# EAGLE design Energy meter1 (EAGLE 7.6.0)
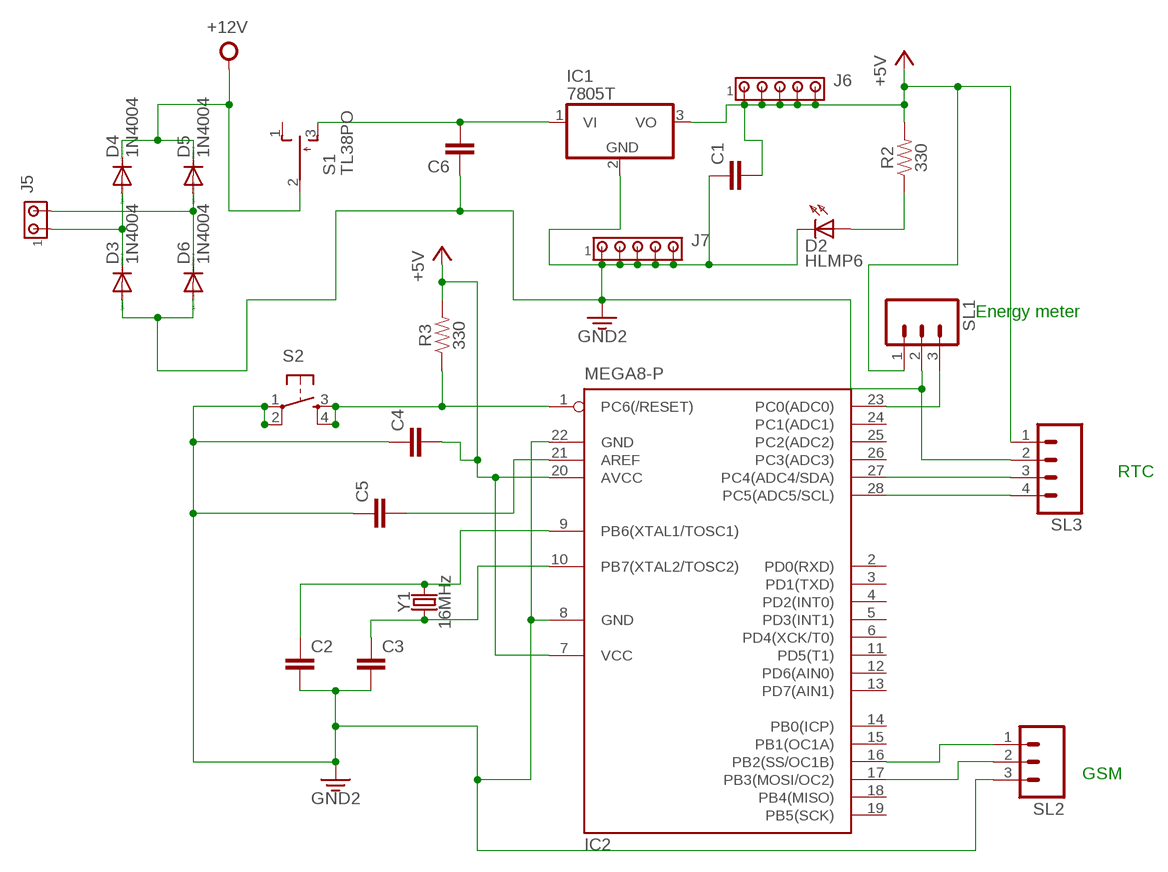
[diagram p0: schematic, sheet 1]

## Parts
C1  C5/2.5  [C5B2.5]
C2  C5/2.5  [C5B2.5]
C3  C5/2.5  [C5B2.5]
C4  C5/2.5  [C5B2.5]
C5  C5/2.5  [C5B2.5]
C6  C5/2.5  [C5B2.5]
D2  HLMP6  [HLMP6]
D3  1N4004  [DO41-10]
D4  1N4004  [DO41-10]
D5  1N4004  [DO41-10]
D6  1N4004  [DO41-10]
IC1  7805T  [TO220H]
IC2  MEGA8-P  [DIL28-3]
J5  MTA02-156  [1X2MTA]
J6  MTA05-100  [10X05MTA]
J7  MTA05-100  [10X05MTA]
R2  330  330OHM-HORIZ-1/10W-5%  [AXIAL-0.3]
R3  330  330OHM-HORIZ-1/10W-5%  [AXIAL-0.3]
S1  TL38PO  [TL3XPO]
S2  TAC_SWITCHPTH  [TACTILE-PTH]
SL1  MA03  [03P]
SL2  MA03  [03P]
SL3  MA04  [04PA]
Y1  16MHz  CRYSTAL-16MHZPTH-HC49US  [HC49US]

## Nets
3.3V: C1.1 C2.2 C3.2 C4.1 C5.1 C6.1 D2.K D3.A D6.A IC1.2(GND) IC2.8(GND) IC2.22(GND) J7.1 J7.2 J7.3 J7.4 J7.5 S2.1 S2.2 SL1.2 SL2.3 SL3.2 ; supply symbol labelled GND2
+5V: C1.2 C4.2 IC1.3(VO) IC2.7(VCC) IC2.20(AVCC) J6.1 J6.2 J6.3 J6.4 J6.5 R2.P$2 R3.P$2 SL1.1 SL3.1
+12V: D4.C D5.C S1.2(P)
N$1: IC2.1(PC6(/RESET)) R3.P$1 S2.3 S2.4
N$2: IC2.23(PC0(ADC0)) SL1.3
N$3: D3.C D4.A J5.1
N$4: C5.2 IC2.21(AREF)
N$5: C2.1 IC2.9(PB6(XTAL1/TOSC1)) Y1.2
N$6: IC2.16(PB2(SS/OC1B)) SL2.1
N$7: D2.A R2.P$1
N$8: C3.1 IC2.10(PB7(XTAL2/TOSC2)) Y1.1
N$9: D5.A D6.C J5.2
N$10: IC2.17(PB3(MOSI/OC2)) SL2.2
N$11: IC2.27(PC4(ADC4/SDA)) SL3.3
N$12: IC2.28(PC5(ADC5/SCL)) SL3.4
N$16: C6.2 IC1.1(VI) S1.3(S)
Unconnected: IC2.2(PD0(RXD)) IC2.3(PD1(TXD)) IC2.4(PD2(INT0)) IC2.5(PD3(INT1)) IC2.6(PD4(XCK/T0)) IC2.11(PD5(T1)) IC2.12(PD6(AIN0)) IC2.13(PD7(AIN1)) IC2.14(PB0(ICP)) IC2.15(PB1(OC1A)) IC2.18(PB4(MISO)) IC2.19(PB5(SCK)) IC2.24(PC1(ADC1)) IC2.25(PC2(ADC2)) IC2.26(PC3(ADC3)) S1.1(O)

## Notes on the sheet
- Energy meter
- RTC
- GSM

## Library data of the parts
C1-C6 = capacitor-wima:C: CAPACITOR naming: grid - package width
D2 = display-hp:HLMP6: LED 2mm horizontal; MF: AGILENT TECHNOLOGIES; MPN: HLMP-6500; OC_FARNELL: 1652490; OC_NEWARK: 40K0088
D3-D6 = diode:1N4004: DIODE general purpose rectifier, 1 A
IC1 = linear:78*: Positive VOLTAGE REGULATOR Source: http://cache.national.com/ds/LM/LM78L05.pdf http://www.fairchildsemi.com/ds/LM/LM7805.pdf
IC2 = atmel:MEGA8-P: MICROCONTROLLER 8 Kbytes FLASH, 1 kbytes SRAM, 512 bytes EEPROM, USART, 4-channel 10 bit ADC, 2-channel 8 bit ADC Pin compatible with Atmega48, ATMega88, ATMega168 Source: avr.lbr; OC_FARNELL: unknown; OC_NEWARK: unknown
J5 = con-amp:MTA02-156: AMP connector
J6 J7 = con-amp:MTA05-100: AMP connector
R2 R3 = SparkFun-Resistors:330OHM: 330Ω resistor A resistor is a passive two-terminal electrical component that implements electrical resistance as a circuit element. Resistors act to reduce current flow, and, at the same time, act to lower voltage levels within circuits. - Wikipedia; PROD_ID: RES-8371
S1 = switch:TL38PO: TINY SWITCH ON OFF MOM Source: http://www2.produktinfo.conrad.com/datenblaetter/700000-724999/705152-da-01-de-Subminiaturschalter_TL_36YO.pdf
S2 = SparkFun-Retired:TAC_SWITCH: Momentary Switch Button commonly used for reset or general input. Spark Fun Electronics SKU : COM-00097 SMT- SWCH-08247
SL1 SL2 = con-amp-quick:MA03: AMP QUICK CONNECTOR; OC_FARNELL: unknown; OC_NEWARK: unknown
SL3 = con-amp-quick:MA04: AMP QUICK CONNECTOR; OC_FARNELL: unknown; OC_NEWARK: unknown
Y1 = SparkFun-Clocks:CRYSTAL-16MHZ: 16MHz Crystal Digikey Example <http://www.digikey.com/product-search/en?keywords=535-9122-1-ND> Frequency: 16MHz Frequency Stability: ±50ppm Frequency Tolerance: ±20ppm Load Capacitance: 18pF SparkFun Products: Pro Micro -5V/16MHz <https://www.sparkfun.com/products/12640> SparkFun Serial Enabled LCD Kit <https://www.sparkfun.com/products/10097>; PROD_ID: XTAL-08181; SF_ID: COM-00536

## Board
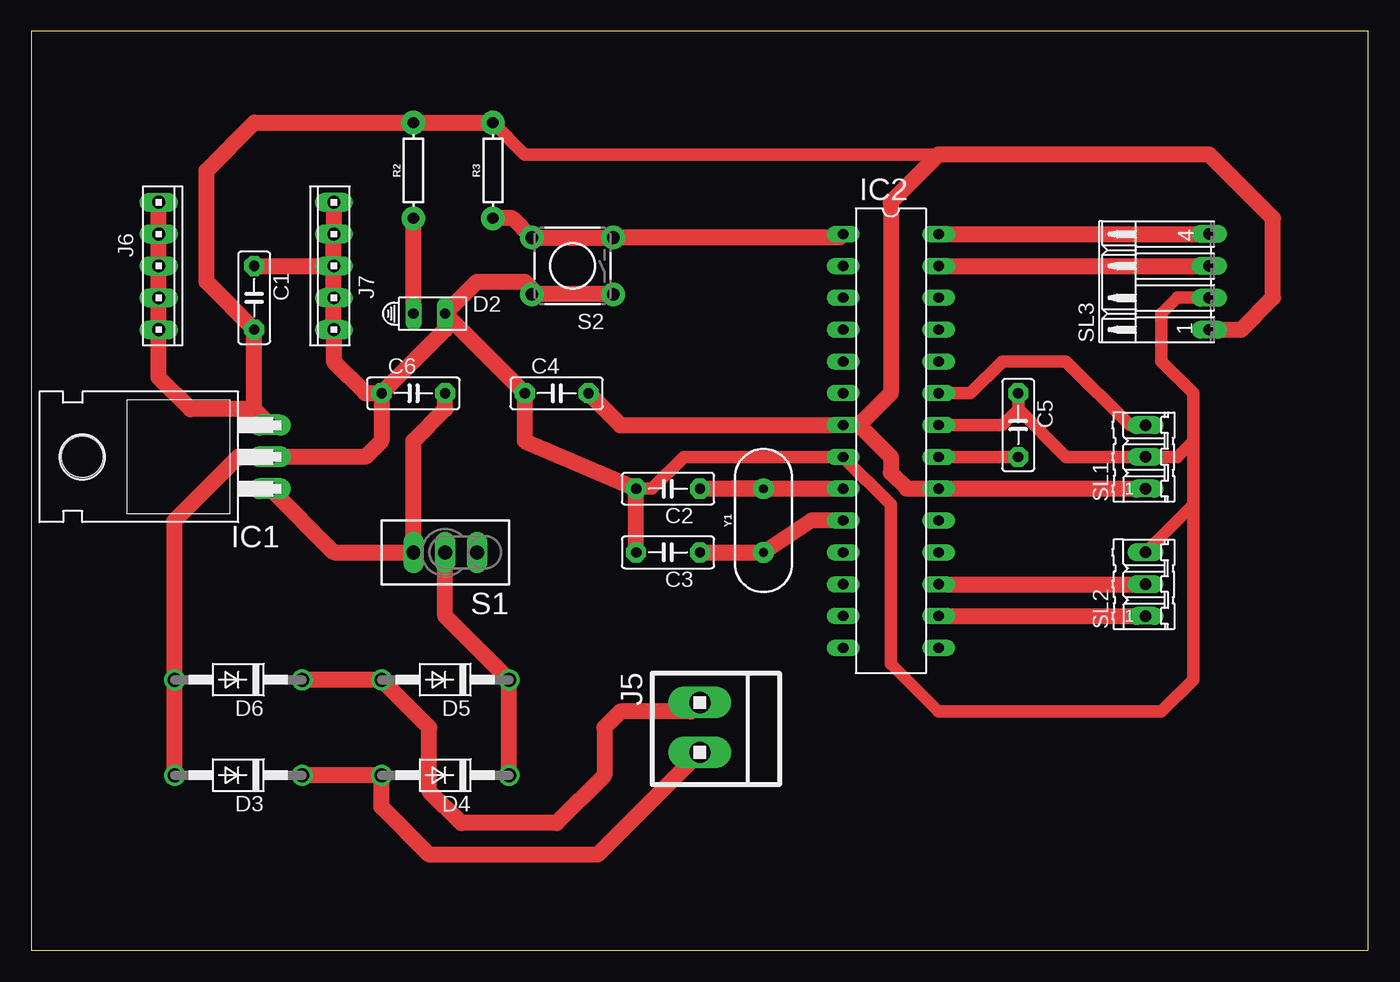
[diagram p1: board, top side]

Size 106.66 x 73.33 mm. Coordinates in mm from the lower left corner, seen from the top.
Outline: 0,0 106.66,0 106.66,73.33 0,73.33 0,0
Copper layers (1*16): Top 0.035mm / dielectric 1.5mm / Bottom 0.035mm
Design rules "default": minimum track width 10mil, minimum drill 24mil, track to track 8mil, track to pad 8mil, pad to pad 8mil, via to via 8mil, smd to smd 8mil, copper to edge 40mil, drill to drill 8mil, minimum pad ring 10mil, minimum via ring 8mil, stop-mask expansion 4mil, vias tented up to drill 0mil, thermal gap 10mil

### Footprints (pad centres in the part's own frame; a part is rotated, then mirrored left to right if it is on the bottom)
C5B2.5 = drill 0.813 pad 1.6 octagon: 1 -2.54,0; 2 2.54,0
HLMP6 = drill 0.813 long: A -1.27,0; K 1.27,0
DO41-10 = drill 1.118: A 5.08,0; C -5.08,0
TO220H = drill 1.118 long: 1 -2.54,-10.16; 2 0,-10.16; 3 2.54,-10.16 | hole 3.302: 0,4.826
DIL28-3 = drill 0.813 long: 1 -16.51,-3.81; 2 -13.97,-3.81; 3 -11.43,-3.81; 4 -8.89,-3.81; 5 -6.35,-3.81; 6 -3.81,-3.81; 7 -1.27,-3.81; 8 1.27,-3.81; 9 3.81,-3.81; 10 6.35,-3.81; 11 8.89,-3.81; 12 11.43,-3.81; 13 13.97,-3.81; 14 16.51,-3.81; 15 16.51,3.81; 16 13.97,3.81; 17 11.43,3.81; 18 8.89,3.81; 19 6.35,3.81; 20 3.81,3.81; 21 1.27,3.81; 22 -1.27,3.81; 23 -3.81,3.81; 24 -6.35,3.81; 25 -8.89,3.81; 26 -11.43,3.81; 27 -13.97,3.81; 28 -16.51,3.81
1X2MTA = drill 1.676 long: 1 1.981,0; 2 -1.981,0
10X05MTA = drill 1.016 long: 1 5.08,0; 2 2.54,0; 3 0,0; 4 -2.54,0; 5 -5.08,0
AXIAL-0.3 = drill 0.9 pad 1.88: P$1 -3.81,0; P$2 3.81,0
TL3XPO = drill 1.1 pad 1.422 long: 1 -2.54,0; 2 0,0; 3 2.54,0
TACTILE-PTH = drill 1.016 pad 1.88: 1 -3.251,2.261; 2 3.251,2.261; 3 -3.251,-2.261; 4 3.251,-2.261
03P = drill 0.914 long: 1 -2.54,0; 2 0,0; 3 2.54,0
04PA = drill 0.914 long: 1 -3.81,0; 2 -1.27,0; 3 1.27,0; 4 3.81,0
HC49US = drill 0.7 pad 1.651: 1 -2.54,0; 2 2.54,0

### Placement (x,y rotation side)
C1  17.78,52.07 270 top
C2  50.8,36.83 180 top
C3  50.8,31.75 180 top
C4  41.91,44.45 0 top
C5  78.74,41.91 270 top
C6  30.48,44.45 0 top
D2  31.75,50.8 0 top
D3  16.51,13.97 180 top
D4  33.02,13.97 180 top
D5  33.02,21.59 180 top
D6  16.51,21.59 180 top
IC1  8.89,39.37 90 top
IC2  68.58,40.64 270 top
J5  53.34,17.78 270 top
J6  10.16,54.61 270 top
J7  24.13,54.61 90 top
R2  30.48,62.23 90 top
R3  36.83,62.23 90 top
S1  33.02,31.75 180 top
S2  43.18,54.61 180 top
SL1  88.9,39.37 90 top
SL2  88.9,29.21 90 top
SL3  93.98,53.34 90 top
Y1  58.42,34.29 90 top

### Tracks (layer width: path | path; a pad name or v marks a point on that pad's centre or on a via)
3.3V
  Top 1.016: IC2.22 77.47,41.91 78.74,43.18 | 78.74,43.18 C5.1 | 78.74,43.18 82.55,39.37 SL1.2 91.44,39.37 92.71,40.64 | SL3.2 91.44,52.07 90.17,50.8 90.17,46.99 92.71,44.45 92.71,40.64 | SL2.3 92.71,35.56 | 92.71,35.56 92.71,40.64 | C2.2 49.53,36.83 52.07,39.37 IC2.8 68.58,35.56 68.58,22.86 72.39,19.05 90.17,19.05 92.71,21.59 92.71,35.56
  Top 1.27: D3.A D6.A 11.43,34.29 16.51,39.37 IC1.2 26.67,39.37 27.94,40.64 C6.1 | C3.2 C2.2 39.37,40.64 C4.1 D2.K | C1.1 J7.3 | J7.1 J7.2 J7.3 | J7.3 J7.4 J7.5 24.13,46.99 26.67,44.45 C6.1 | C6.1 33.02,49.53 D2.K | D2.K 35.56,53.34 39.37,53.34 39.93,52.78 S2.2 S2.1
+5V
  Top 1.016: R3.P$2 39.37,63.5 72.39,63.5
  Top 1.27: SL1.1 IC2.20 69.85,36.83 68.58,38.1 68.58,39.37 66.04,41.91 | IC1.3 17.78,43.18 | 17.78,43.18 12.7,43.18 10.16,45.72 J6.1 J6.2 J6.3 J6.4 J6.5 | 17.78,43.18 C1.2 13.97,53.34 13.97,62.23 17.78,66.04 R2.P$2 R3.P$2 | C4.2 46.99,41.91 IC2.7 66.04,41.91 | SL3.1 96.52,49.53 99.06,52.07 99.06,58.42 93.98,63.5 72.39,63.5 68.58,59.69 68.58,44.45 66.04,41.91
+12V
  Top 1.27: D4.C D5.C 33.02,26.67 S1.2
N$1
  Top 1.27: IC2.1 64.49,56.87 S2.3 S2.4 38.38,58.42 R3.P$1
N$2
  Top 1.016: IC2.23 74.93,44.45 77.47,46.99 82.55,46.99 87.63,41.91 SL1.3
N$3
  Top 1.27: J5.1 45.16,7.62 31.75,7.62 27.94,11.43 D4.A D3.C
N$4
  Top 1.016: IC2.21 C5.2
N$5
  Top 1.27: Y1.2 55.88,36.83 | Y1.2 IC2.9 | C2.1 Y1.2
N$6
  Top 1.27: IC2.16 SL2.1
N$7
  Top 1.27: D2.A R2.P$1
N$8
  Top 1.27: IC2.10 62.23,34.29 Y1.1 C3.1
N$9
  Top 1.27: J5.2 52.63,19.05 46.99,19.05 45.72,17.78 45.72,13.97 41.91,10.16 34.29,10.16 31.75,12.7 31.75,17.78 D5.A D6.C
N$10
  Top 1.27: IC2.17 SL2.2
N$11
  Top 1.27: IC2.27 SL3.3
N$12
  Top 1.27: IC2.28 SL3.4
N$16
  Top 1.27: IC1.1 24.13,31.75 S1.3 30.48,40.64 33.02,43.18 C6.2